# Altium schematic sheet 9_USB_Connectors.SchDoc: Apalis Evaluation Board 1.1
size A3; Organization: Toradex AG; Address1: Altsagenstrasse 5; Address2: Horw; Address3: 6048; Address4: Switzerland; DocumentNumber: 7; Revision: V1.1; SheetNumber: 7; SheetTotal: 32; PageSetup: Record=PageOptions|CenterHorizontal=True|CenterVertical=True|PrintScale=0.71|XCorrection=1.00|YCorrection=1.00|PrintKind=0|BorderSize=5000000|LeftOffset=0|BottomOffset=0|Orientation=2|PaperLength=1000|PaperWidth=1000|Scale=100|PaperSource=7|PrintQuality=-4|MediaType=1|DitherType=10|PaperKind=A4|PrintScaleMode=1
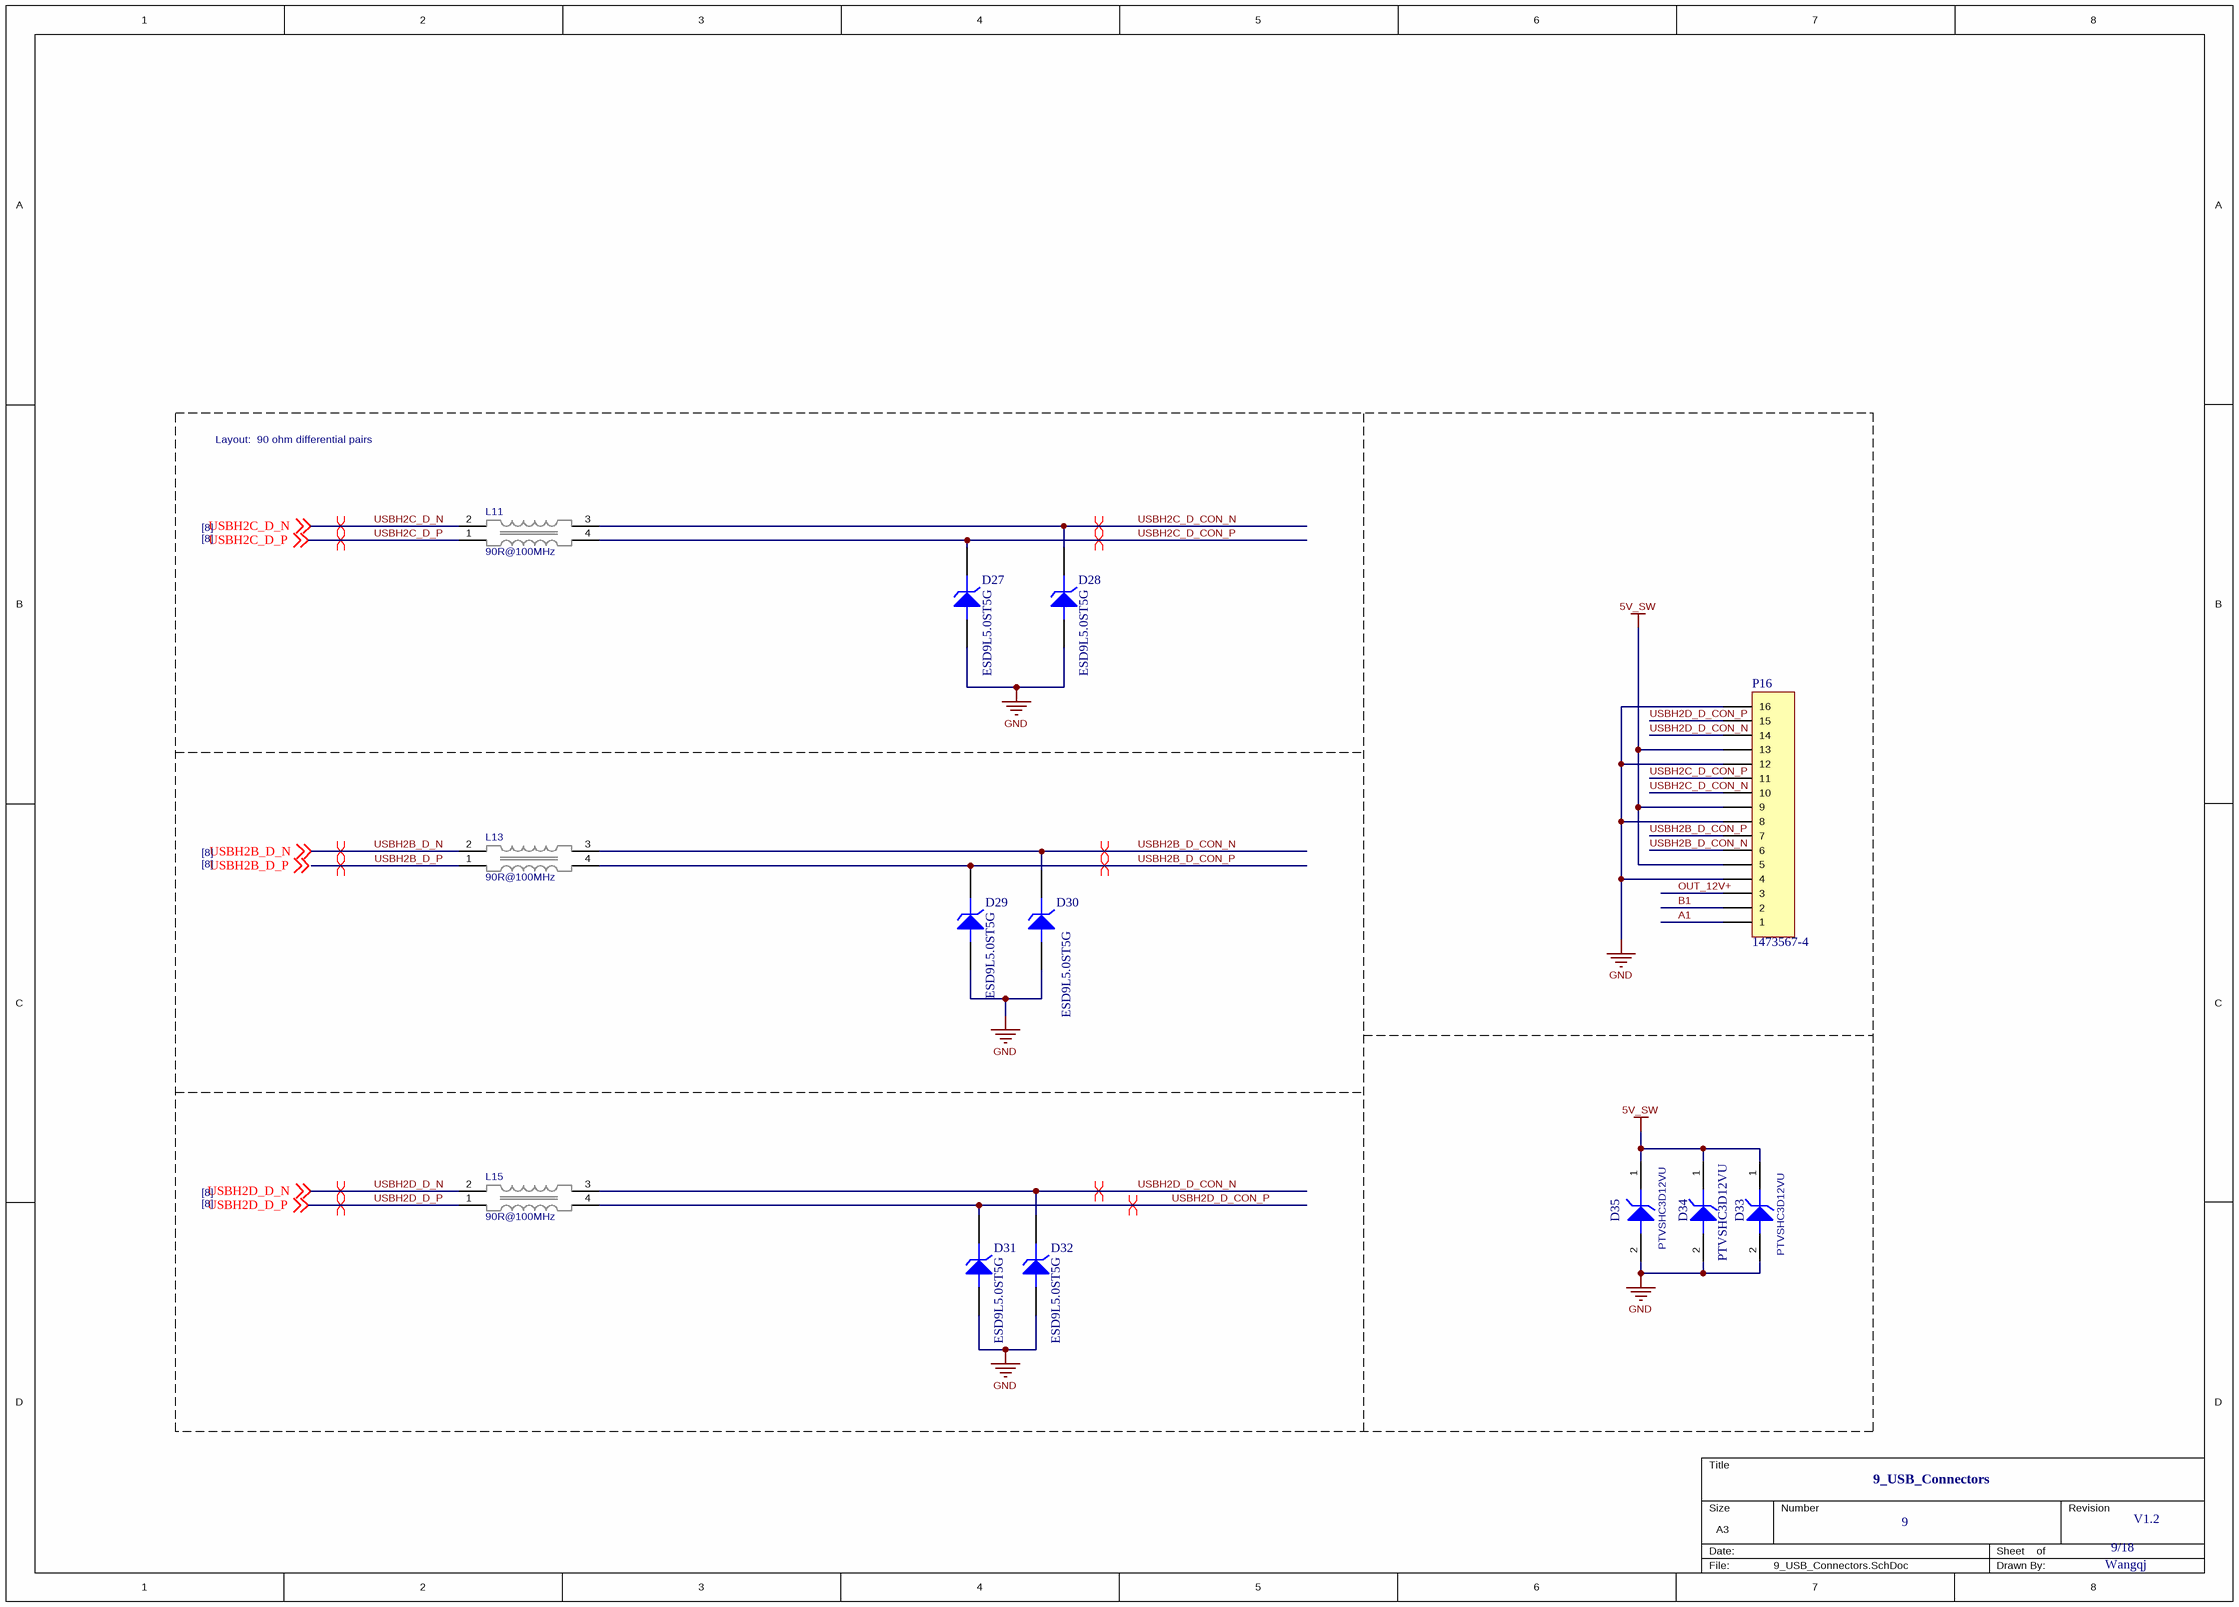
[diagram p0: 9_USB_Connectors.SchDoc]

## Parts
D27  ESD9L5.0ST5G  [LC-SOD-923]
D28  ESD9L5.0ST5G  [LC-SOD-923]
D29  ESD9L5.0ST5G  [LC-SOD-923]
D30  ESD9L5.0ST5G  [LC-SOD-923]
D31  ESD9L5.0ST5G  [LC-SOD-923]
D32  ESD9L5.0ST5G  [LC-SOD-923]
D33  PTVSHC3D12VU  [LC-SOD-323]
D34  PTVSHC3D12VU  [LC-SOD-323]
D35  PTVSHC3D12VU  [LC-SOD-323]
L11  90R@100MHz  [T_Murata_DLW21SN900SQ2]
L13  90R@100MHz  [T_Murata_DLW21SN900SQ2]
L15  90R@100MHz  [T_Murata_DLW21SN900SQ2]
P16  1473567-4  [147-4]

## Nets
5V_SW: D33.1(K) D34.1(K) D35.1(K) P16.5 P16.9 P16.13
GND: D27.1(A) D28.1(A) D29.1(A) D30.1(A) D31.1(A) D32.1(A) D33.2(A) D34.2(A) D35.2(A) P16.4 P16.8 P16.12 P16.16
A1: P16.1
B1: P16.2
OUT_12V+: P16.3
USBH2B_D_CON_N: D30.2(K) L13.3 P16.6
USBH2B_D_CON_P: D29.2(K) L13.4 P16.7
USBH2B_D_N: L13.2 ; off-sheet USBH2B_D_N
USBH2B_D_P: L13.1 ; off-sheet USBH2B_D_P
USBH2C_D_CON_N: D28.2(K) L11.3 P16.10
USBH2C_D_CON_P: D27.2(K) L11.4 P16.11
USBH2C_D_N: L11.2 ; off-sheet USBH2C_D_N
USBH2C_D_P: L11.1 ; off-sheet USBH2C_D_P
USBH2D_D_CON_N: D32.2(K) L15.3 P16.14
USBH2D_D_CON_P: D31.2(K) L15.4 P16.15
USBH2D_D_N: L15.2 ; off-sheet USBH2D_D_N
USBH2D_D_P: L15.1 ; off-sheet USBH2D_D_P

## Layout directives
differential pair: USBH2B_D_CON_N, USBH2B_D_CON_P, USBH2B_D_N, USBH2B_D_P, USBH2C_D_CON_N, USBH2C_D_CON_P, USBH2C_D_N, USBH2C_D_P, USBH2D_D_CON_N, USBH2D_D_CON_P, USBH2D_D_N, USBH2D_D_P

## Notes on the sheet
- Layout:  90 ohm differential pairs
- [8]
- 9_USB_Connectors
- 9
- 9/18
- V1.2
- Wangqj
- Labels drawn without touching a wire or pin: USBH2B_D_P
- Title
- Size:
- Date:
- A3
- Number:
- Time:
- Revision:
- Sheet
- of
- File:

## Library data of the parts
D27-D32 = ZENER3: TVS Diode
D33-D35 = Diode_TVS: TVS Diode
L11 L13 L15 = L-Murata-DLW21SN900SQ2-90R@100MHz-330mA-25%: Common Mode Choke High Speed 90R 330mA; Manufacturer Name: Murata; Tolerance: 25%; Rating: 330mA; Manufacturer Part No.: DLW21SN900SQ2; Value: 90R@100MHz
P16 = Header 16H: 泰科4p端子; LatestRevisionDate: 17-Jul-2002; LatestRevisionNote: Re-released for DXP Platform.; Publisher: Altium Limited